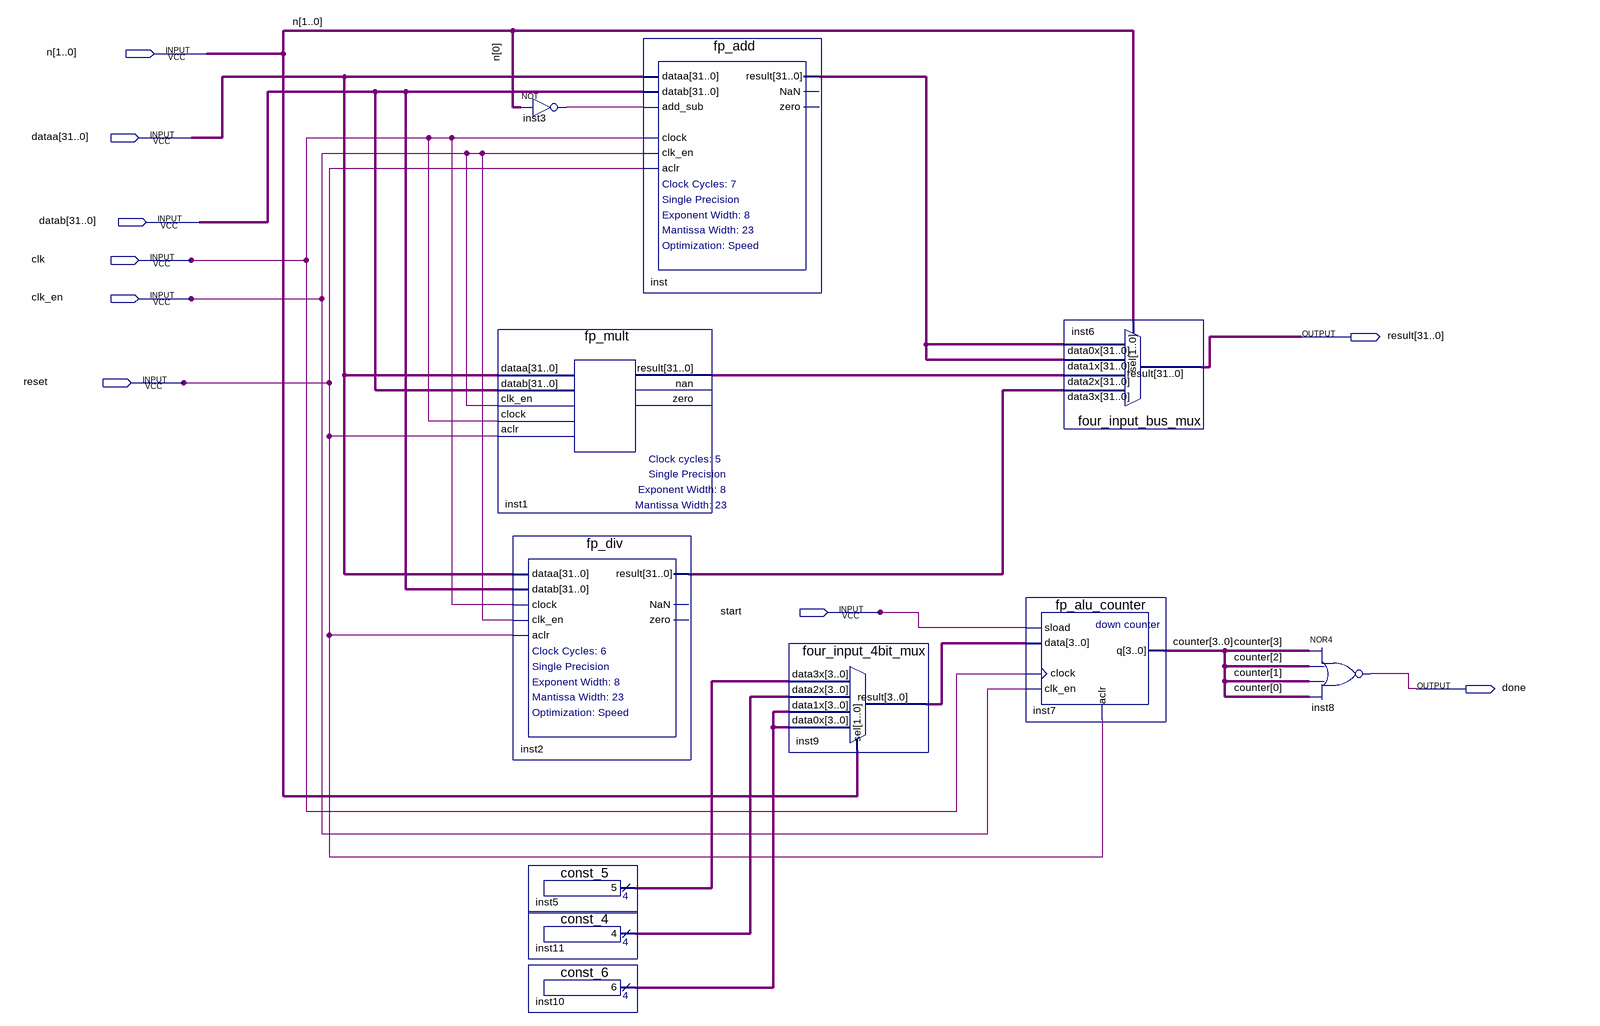
[diagram p0: schematic sheet]
// Quartus schematic fp_alu.bdf as structural Verilog: 11 symbols, 9 pins
module fp_alu (
  input  [1:0] n,
  input  [31:0] dataa,
  input  [31:0] datab,
  input  clk,
  input  clk_en,
  input  reset,
  input  start,
  output [31:0] result,
  output done
);

  wire inst3_out;
  wire [3:0] counter, inst5_result, inst9_result, inst10_result, inst11_result;
  wire [31:0] inst1_result, inst2_result, inst_result;

  not inst3 (inst3_out, n[0]);
  fp_mult inst1 (
    .dataa(dataa), .datab(datab), .clk_en(clk_en), .clock(clk), .aclr(reset), .result(inst1_result));  // open: nan, zero
  fp_div inst2 (
    .dataa(dataa), .datab(datab), .clock(clk), .clk_en(clk_en), .aclr(reset), .result(inst2_result));  // open: NaN, zero
  const_5 inst5 (.result(inst5_result));
  const_4 inst11 (.result(inst11_result));
  const_6 inst10 (.result(inst10_result));
  fp_add inst (
    .dataa(dataa), .datab(datab), .add_sub(inst3_out), .clock(clk), .clk_en(clk_en), .aclr(reset),
    .result(inst_result));  // open: NaN, zero
  four_input_4bit_mux inst9 (
    .data3x(inst5_result), .data2x(inst11_result), .data1x(inst10_result), .data0x(inst10_result), .sel(n),
    .result(inst9_result));
  four_input_bus_mux inst6 (
    .data3x(inst2_result), .data2x(inst1_result), .data1x(inst_result), .data0x(inst_result), .sel(n),
    .result(result));
  fp_alu_counter inst7 (.sload(start), .data(inst9_result), .clock(clk), .clk_en(clk_en), .aclr(reset), .q(counter));
  nor inst8 (done, counter[3], counter[2], counter[1], counter[0]);
endmodule
